# EAGLE schematic board (EAGLE 9.2.0)
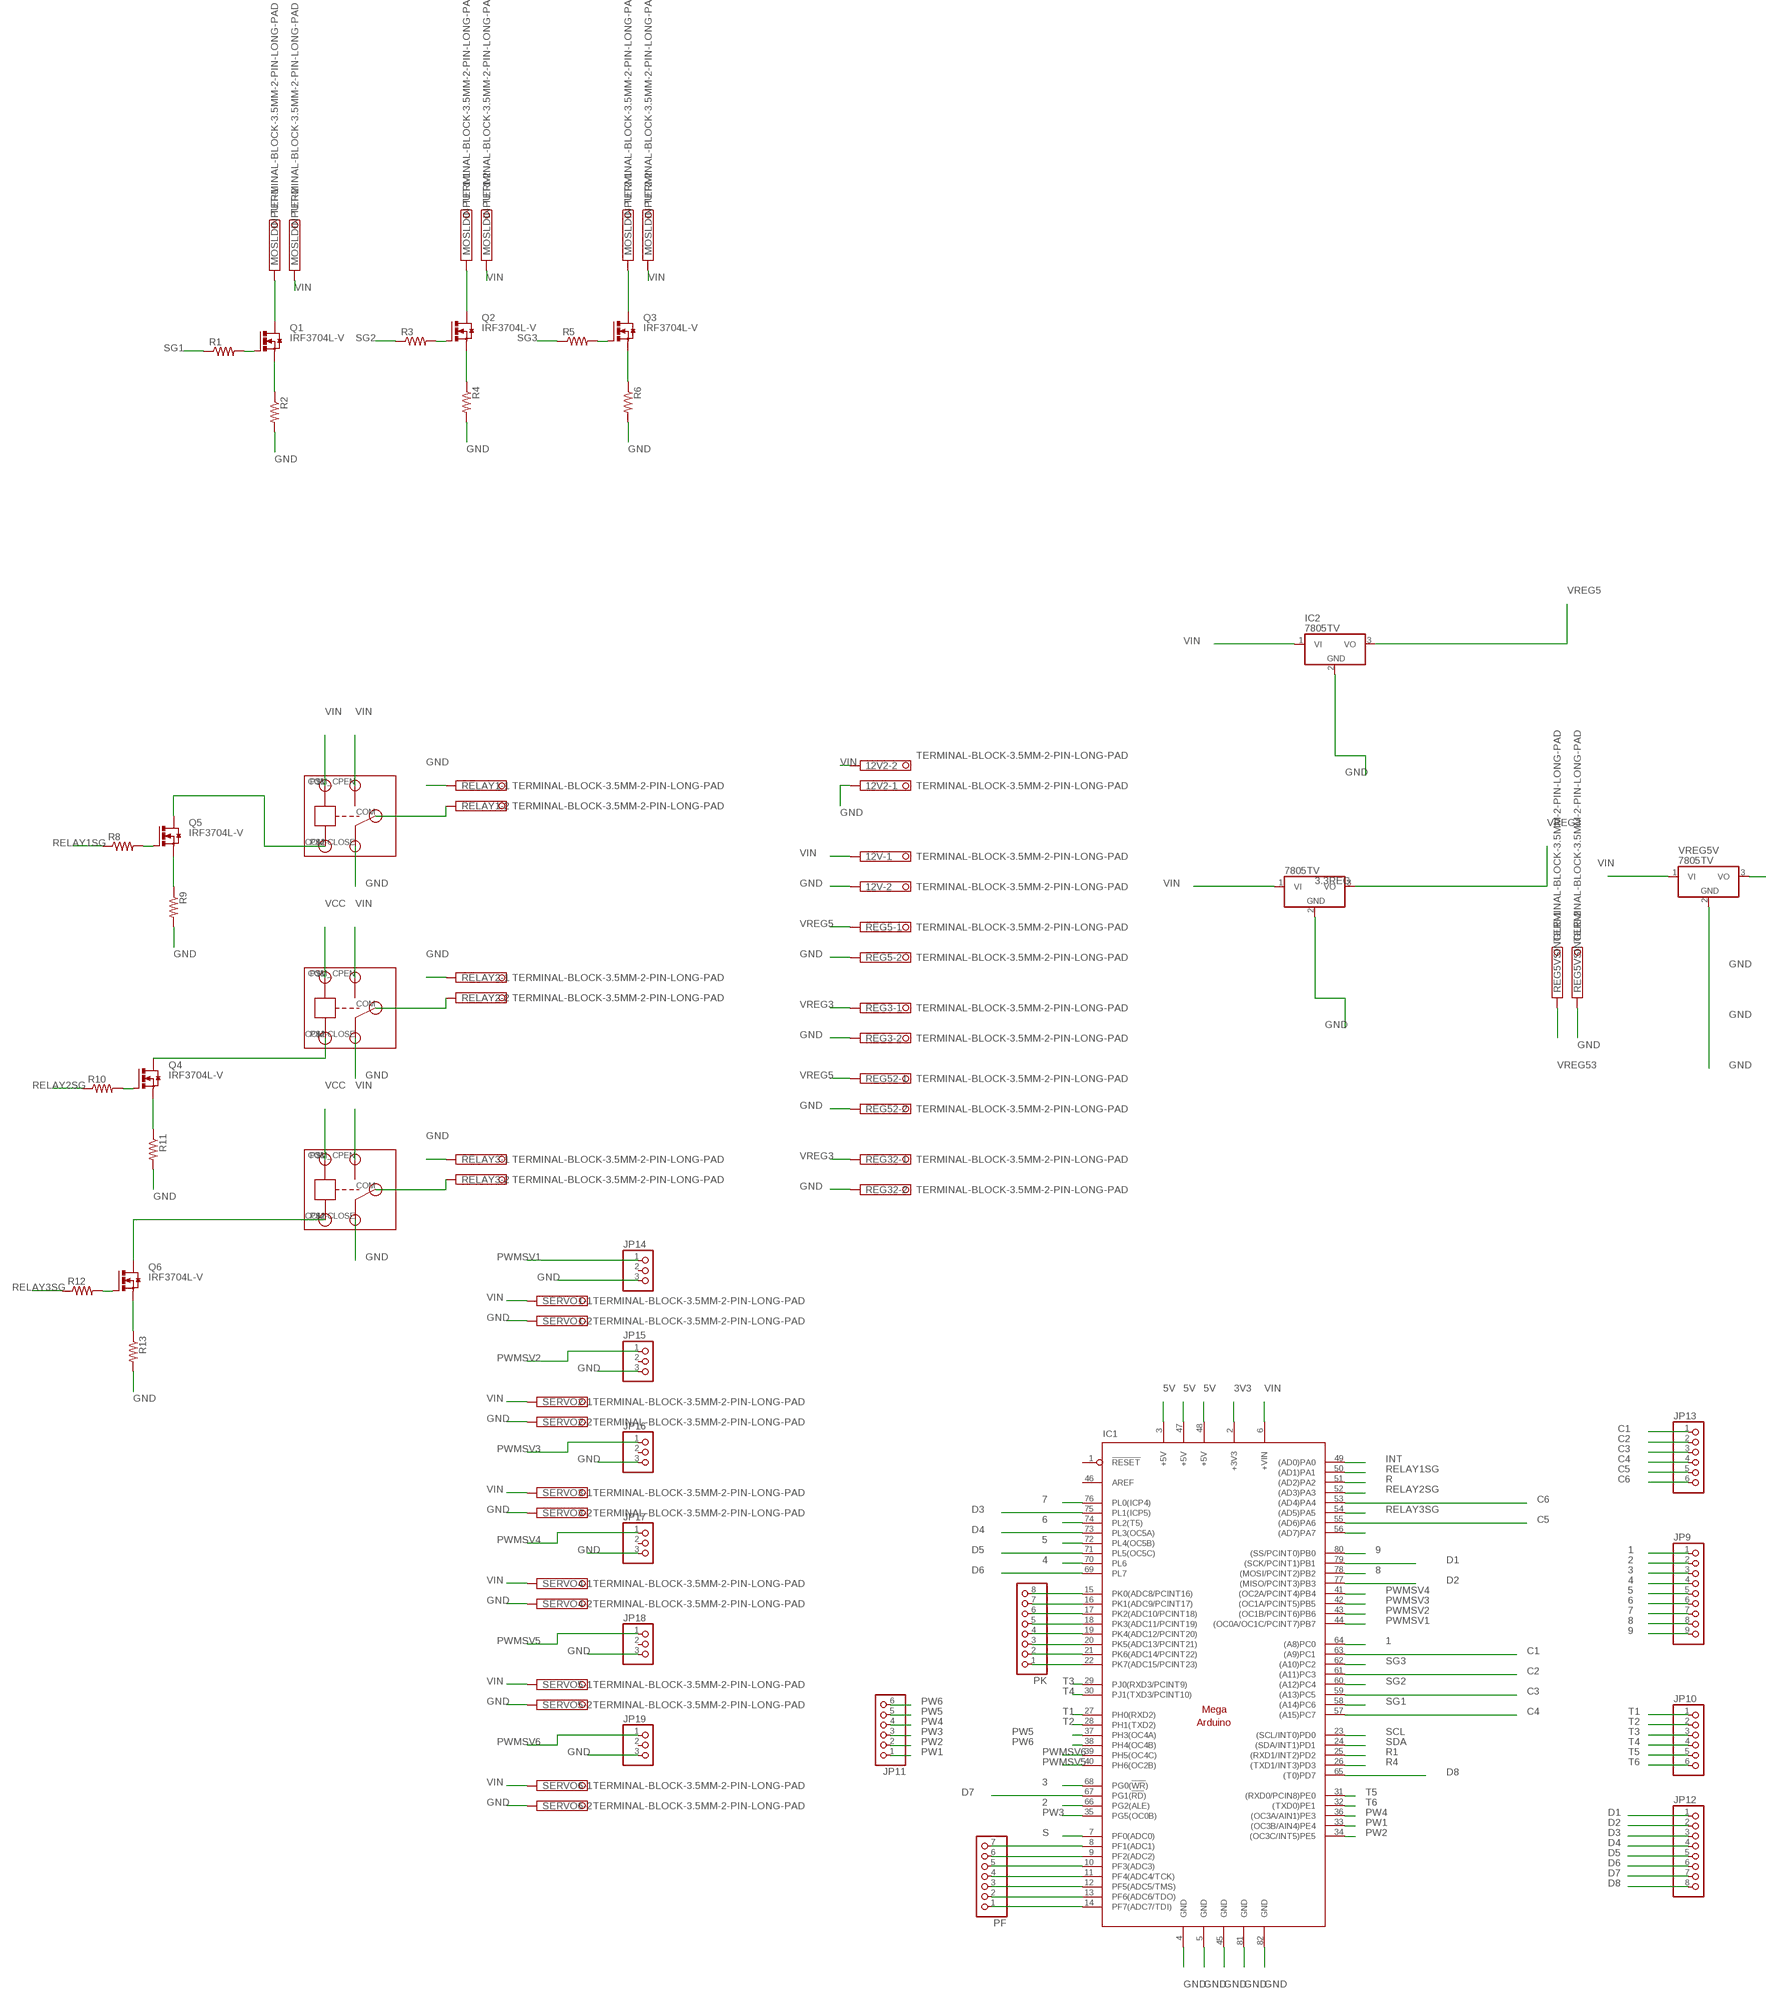
[diagram p0: schematic, sheet 1, part 1 of 2]
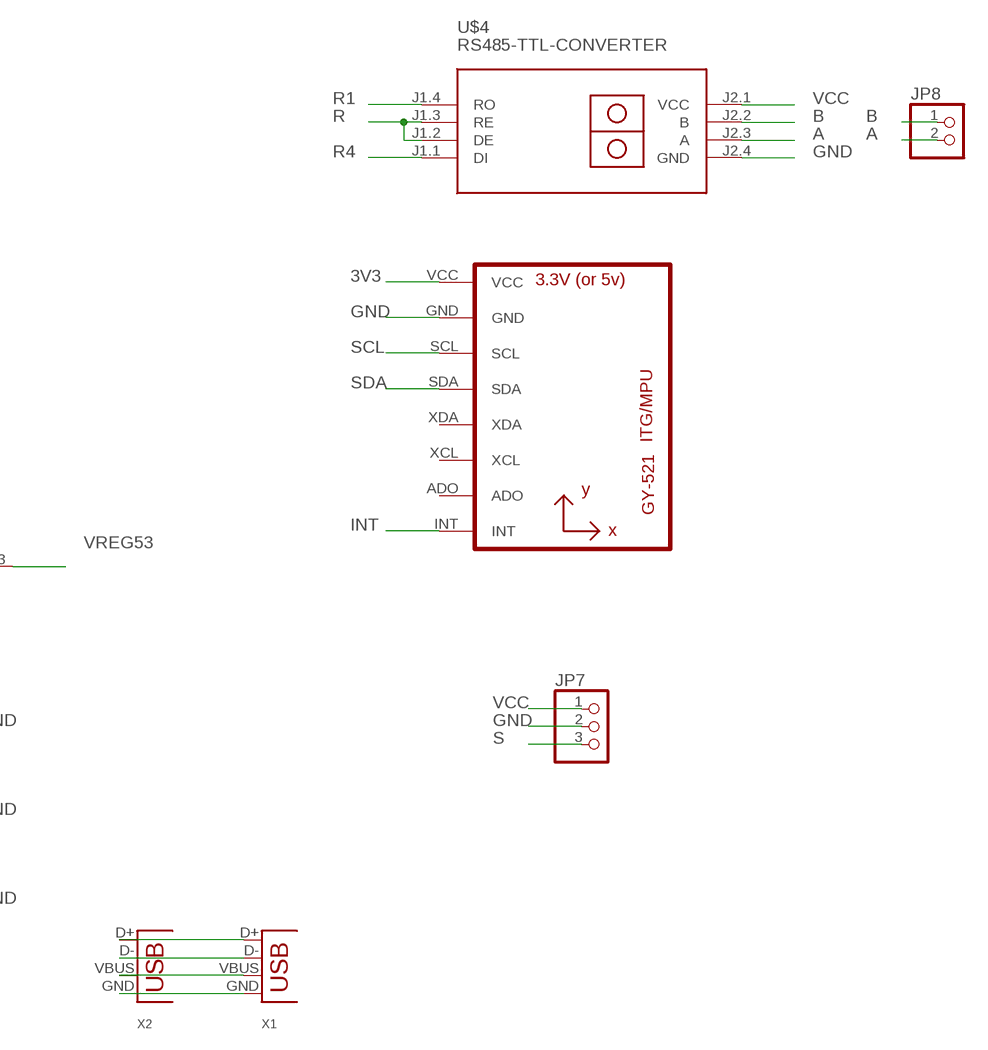
[diagram p1: schematic, sheet 1, part 2 of 2]

## Parts
3.3REG  7805TV  [TO220V]
12V  TERMINAL-BLOCK-3.5MM-2-PIN-LONG-PAD  [TERMINAL-BLOCK-2-PIN-3.5MM-LONG-PAD]
12V2  TERMINAL-BLOCK-3.5MM-2-PIN-LONG-PAD  [TERMINAL-BLOCK-2-PIN-3.5MM-LONG-PAD]
IC1  MEGAARDUINO_11  [MEGA_ARDUINO_1]
IC2  7805TV  [TO220V]
JP7  PINHD-1X3  [1X03]
JP8  PINHD-1X2  [1X02]
JP9  PINHD-1X9  [1X09]
JP10  PINHD-1X6  [1X06]
JP11  PINHD-1X6  [1X06]
JP12  PINHD-1X8  [1X08]
JP13  PINHD-1X6  [1X06]
JP14  PINHD-1X3  [1X03]
JP15  PINHD-1X3  [1X03]
JP16  PINHD-1X3  [1X03]
JP17  PINHD-1X3  [1X03]
JP18  PINHD-1X3  [1X03]
JP19  PINHD-1X3  [1X03]
MOSLDINPUT  TERMINAL-BLOCK-3.5MM-2-PIN-LONG-PAD  [TERMINAL-BLOCK-2-PIN-3.5MM-LONG-PAD]
MOSLDINPUT1  TERMINAL-BLOCK-3.5MM-2-PIN-LONG-PAD  [TERMINAL-BLOCK-2-PIN-3.5MM-LONG-PAD]
MOSLDINPUT2  TERMINAL-BLOCK-3.5MM-2-PIN-LONG-PAD  [TERMINAL-BLOCK-2-PIN-3.5MM-LONG-PAD]
PF  PINHD-1X7  [1X07]
PK  PINHD-1X8  [1X08]
Q1  IRF3704L-V  [TO262-V]
Q2  IRF3704L-V  [TO262-V]
Q3  IRF3704L-V  [TO262-V]
Q4  IRF3704L-V  [TO262-V]
Q5  IRF3704L-V  [TO262-V]
Q6  IRF3704L-V  [TO262-V]
R1  R-US_0204/7  [0204/7]
R2  R-US_0204/7  [0204/7]
R3  R-US_0204/7  [0204/7]
R4  R-US_0204/7  [0204/7]
R5  R-US_0204/7  [0204/7]
R6  R-US_0204/7  [0204/7]
R8  R-US_0204/7  [0204/7]
R9  R-US_0204/7  [0204/7]
R10  R-US_0204/7  [0204/7]
R11  R-US_0204/7  [0204/7]
R12  R-US_0204/7  [0204/7]
R13  R-US_0204/7  [0204/7]
REG3  TERMINAL-BLOCK-3.5MM-2-PIN-LONG-PAD  [TERMINAL-BLOCK-2-PIN-3.5MM-LONG-PAD]
REG5  TERMINAL-BLOCK-3.5MM-2-PIN-LONG-PAD  [TERMINAL-BLOCK-2-PIN-3.5MM-LONG-PAD]
REG5VSINGLE  TERMINAL-BLOCK-3.5MM-2-PIN-LONG-PAD  [TERMINAL-BLOCK-2-PIN-3.5MM-LONG-PAD]
REG32  TERMINAL-BLOCK-3.5MM-2-PIN-LONG-PAD  [TERMINAL-BLOCK-2-PIN-3.5MM-LONG-PAD]
REG52  TERMINAL-BLOCK-3.5MM-2-PIN-LONG-PAD  [TERMINAL-BLOCK-2-PIN-3.5MM-LONG-PAD]
RELAY1  TERMINAL-BLOCK-3.5MM-2-PIN-LONG-PAD  [TERMINAL-BLOCK-2-PIN-3.5MM-LONG-PAD]
RELAY2  TERMINAL-BLOCK-3.5MM-2-PIN-LONG-PAD  [TERMINAL-BLOCK-2-PIN-3.5MM-LONG-PAD]
RELAY3  TERMINAL-BLOCK-3.5MM-2-PIN-LONG-PAD  [TERMINAL-BLOCK-2-PIN-3.5MM-LONG-PAD]
SERVO1  TERMINAL-BLOCK-3.5MM-2-PIN-LONG-PAD  [TERMINAL-BLOCK-2-PIN-3.5MM-LONG-PAD]
SERVO2  TERMINAL-BLOCK-3.5MM-2-PIN-LONG-PAD  [TERMINAL-BLOCK-2-PIN-3.5MM-LONG-PAD]
SERVO3  TERMINAL-BLOCK-3.5MM-2-PIN-LONG-PAD  [TERMINAL-BLOCK-2-PIN-3.5MM-LONG-PAD]
SERVO4  TERMINAL-BLOCK-3.5MM-2-PIN-LONG-PAD  [TERMINAL-BLOCK-2-PIN-3.5MM-LONG-PAD]
SERVO5  TERMINAL-BLOCK-3.5MM-2-PIN-LONG-PAD  [TERMINAL-BLOCK-2-PIN-3.5MM-LONG-PAD]
SERVO6  TERMINAL-BLOCK-3.5MM-2-PIN-LONG-PAD  [TERMINAL-BLOCK-2-PIN-3.5MM-LONG-PAD]
U1  GY-521MPU6050  [GY-521]
U$1  RELAY  [RELAY]
U$2  RELAY  [RELAY]
U$3  RELAY  [RELAY]
U$4  RS485-TTL-CONVERTER  [RS485-TTL-CONVERTER]
VREG5V  7805TV  [TO220V]
X1  USB-A-H  [USB-A-H]
X2  USB-A-H  [USB-A-H]

## Nets
1: IC1.64((A8)PC0) JP9.1
2: IC1.66(PG2(ALE)) JP9.2
3: IC1.68(PG0(!WR!)) JP9.3
3V3: IC1.2(+3V3) U1.VCC
4: IC1.70(PL6) JP9.4
5: IC1.72(PL4(OC5B)) JP9.5
5V: IC1.3(+5V) IC1.47(+5V) IC1.48(+5V)
6: IC1.74(PL2(T5)) JP9.6
7: IC1.76(PL0(ICP4)) JP9.7
8: IC1.78((MOSI/PCINT2)PB2) JP9.8
9: IC1.80((SS/PCINT0)PB0) JP9.9
A: JP8.2 U$4.J2.3(A)
B: JP8.1 U$4.J2.2(B)
C1: IC1.63((A9)PC1) JP13.1
C2: IC1.61((A11)PC3) JP13.2
C3: IC1.59((A13)PC5) JP13.3
C4: IC1.57((A15)PC7) JP13.4
C5: IC1.55((AD6)PA6) JP13.5
C6: IC1.53((AD4)PA4) JP13.6
D1: IC1.79((SCK/PCINT1)PB1) JP12.1
D2: IC1.77((MISO/PCINT3)PB3) JP12.2
D3: IC1.75(PL1(ICP5)) JP12.3
D4: IC1.73(PL3(OC5A)) JP12.4
D5: IC1.71(PL5(OC5C)) JP12.5
D6: IC1.69(PL7) JP12.6
D7: IC1.67(PG1(!RD!)) JP12.7
D8: IC1.65((T0)PD7) JP12.8
GND: 3.3REG.2(GND) 12V2.1 12V.2 IC1.4(GND) IC1.5(GND) IC1.45(GND) IC1.81(GND) IC1.82(GND) IC2.2(GND) JP7.2 JP14.3 JP15.3 JP16.3 JP17.3 JP18.3 JP19.3 R2.2 R4.2 R6.2 R9.2 R11.2 R13.2 REG3.2 REG5.2 REG5VSINGLE.2 REG32.2 REG52.2 RELAY1.1 RELAY2.1 RELAY3.1 SERVO1.2 SERVO2.2 SERVO3.2 SERVO4.2 SERVO5.2 SERVO6.2 U1.GND U$1.COM-CLOSE U$2.COM-CLOSE U$3.COM-CLOSE U$4.J2.4(GND) VREG5V.2(GND)
INT: IC1.49((AD0)PA0) U1.INT
N$1: Q1.1(G) R1.2
N$2: MOSLDINPUT.1 Q1.2(D)
N$3: Q1.3(S) R2.1
N$4: Q2.1(G) R3.2
N$5: Q2.3(S) R4.1
N$6: MOSLDINPUT1.1 Q2.2(D)
N$7: Q3.1(G) R5.2
N$8: Q3.3(S) R6.1
N$9: MOSLDINPUT2.1 Q3.2(D)
N$10: RELAY1.2 U$1.COM
N$11: RELAY2.2 U$2.COM
N$12: RELAY3.2 U$3.COM
N$13: IC1.8(PF1(ADC1)) PF.7
N$14: IC1.9(PF2(ADC2)) PF.6
N$15: IC1.10(PF3(ADC3)) PF.5
N$16: Q5.1(G) R8.2
N$17: Q5.3(S) R9.1
N$22: X1.GND X2.GND
N$23: X1.VBUS X2.VBUS
N$24: IC1.56((AD7)PA7)
N$25: Q5.2(D) U$1.P$2(GND)
N$26: Q4.1(G) R10.2
N$27: Q4.3(S) R11.1
N$28: IC1.11(PF4(ADC4/TCK)) PF.4
N$29: Q4.2(D) U$2.P$2(GND)
N$30: Q6.1(G) R12.2
N$31: Q6.3(S) R13.1
N$32: Q6.2(D) U$3.P$2(GND)
N$33: IC1.12(PF5(ADC5/TMS)) PF.3
N$34: IC1.13(PF6(ADC6/TDO)) PF.2
N$35: IC1.14(PF7(ADC7/TDI)) PF.1
N$36: IC1.15(PK0(ADC8/PCINT16)) PK.8
N$37: IC1.16(PK1(ADC9/PCINT17)) PK.7
N$38: IC1.17(PK2(ADC10/PCINT18)) PK.6
N$39: IC1.18(PK3(ADC11/PCINT19)) PK.5
N$40: IC1.19(PK4(ADC12/PCINT20)) PK.4
N$41: IC1.20(PK5(ADC13/PCINT21)) PK.3
N$42: IC1.21(PK6(ADC14/PCINT22)) PK.2
N$43: IC1.22(PK7(ADC15/PCINT23)) PK.1
N$44: X1.D- X2.D-
N$45: X1.D+ X2.D+
PW1: IC1.33((OC3B/AIN4)PE4) JP11.1
PW2: IC1.34((OC3C/INT5)PE5) JP11.2
PW3: IC1.35(PG5(OC0B)) JP11.3
PW4: IC1.36((OC3A/AIN1)PE3) JP11.4
PW5: IC1.37(PH3(OC4A)) JP11.5
PW6: IC1.38(PH4(OC4B)) JP11.6
PWMSV1: IC1.44((OC0A/OC1C/PCINT7)PB7) JP14.1
PWMSV2: IC1.43((OC1B/PCINT6)PB6) JP15.1
PWMSV3: IC1.42((OC1A/PCINT5)PB5) JP16.1
PWMSV4: IC1.41((OC2A/PCINT4)PB4) JP17.1
PWMSV5: IC1.40(PH6(OC2B)) JP18.1
PWMSV6: IC1.39(PH5(OC4C)) JP19.1
R: IC1.51((AD2)PA2) U$4.J1.2(DE) U$4.J1.3(RE)
R1: IC1.25((RXD1/INT2)PD2) U$4.J1.4(RO)
R4: IC1.26((TXD1/INT3)PD3) U$4.J1.1(DI)
RELAY1SG: IC1.50((AD1)PA1) R8.1
RELAY2SG: IC1.52((AD3)PA3) R10.1
RELAY3SG: IC1.54((AD5)PA5) R12.1
S: IC1.7(PF0(ADC0)) JP7.3
SCL: IC1.23((SCL/INT0)PD0) U1.SCL
SDA: IC1.24((SDA/INT1)PD1) U1.SDA
SG1: IC1.58((A14)PC6) R1.1
SG2: IC1.60((A12)PC4) R3.1
SG3: IC1.62((A10)PC2) R5.1
T1: IC1.27(PH0(RXD2)) JP10.1
T2: IC1.28(PH1(TXD2)) JP10.2
T3: IC1.29(PJ0(RXD3/PCINT9)) JP10.3
T4: IC1.30(PJ1(TXD3/PCINT10)) JP10.4
T5: IC1.31((RXD0/PCIN8)PE0) JP10.5
T6: IC1.32((TXD0)PE1) JP10.6
VCC: JP7.1 U$2.P$1(IN) U$3.P$1(IN) U$4.J2.1(VCC)
VIN: 3.3REG.1(VI) 12V2.2 12V.1 IC1.6(+VIN) IC2.1(VI) MOSLDINPUT1.2 MOSLDINPUT2.2 MOSLDINPUT.2 SERVO1.1 SERVO2.1 SERVO3.1 SERVO4.1 SERVO5.1 SERVO6.1 U$1.COM_CPEN(COM-OPEN) U$1.P$1(IN) U$2.COM_CPEN(COM-OPEN) U$3.COM_CPEN(COM-OPEN) VREG5V.1(VI)
VREG3: 3.3REG.3(VO) REG3.1 REG32.1
VREG5: IC2.3(VO) REG5.1 REG52.1
VREG53: REG5VSINGLE.1 VREG5V.3(VO)
Unconnected: IC1.1(!RESET) IC1.46(AREF) JP14.2 JP15.2 JP16.2 JP17.2 JP18.2 JP19.2 U1.ADO U1.XCL U1.XDA

## Library data of the parts
3.3REG IC2 VREG5V = linear:78*: Positive VOLTAGE REGULATOR Source: http://cache.national.com/ds/LM/LM78L05.pdf http://www.fairchildsemi.com/ds/LM/LM7805.pdf
12V 12V2 MOSLDINPUT MOSLDINPUT1 MOSLDINPUT2 REG3 REG5 REG5VSINGLE REG32 REG52 RELAY1-RELAY3 SERVO1-SERVO6 = Rembrandt Electronics - Terminal Block 3-5mm v1-0:TERMINAL-BLOCK-3.5MM-2-PIN: Terminal Block 3.5mm Pitch: 3,5 mm Number of pins: 2 Created by Rembrandt Electronics www.rembrandtelectronics.com
IC1 = arduino:MEGAARDUINO_1: The Arduino Mega is a microcontroller board based on the ATmega1280. - 54 digital input/output pins (of which 14 can be used as PWM outputs) - 16 analog inputs - 4 UARTs (hardware serial ports) - 16 MHz crystal oscillator - USB connection - power jack - ICSP header - reset button It contains everything needed to support the microcontroller; simply connect it to a computer with a USB cable or power it with a AC-to-DC adapter or battery to get started. The Mega is compatible with most shields designed for the Arduino Duemilanove or Diecimila. http://arduino.cc/en/Main/ArduinoBoardMega
JP7 JP14-JP19 = pinhead:PINHD-1X3: PIN HEADER
JP8 = pinhead:PINHD-1X2: PIN HEADER
JP9 = pinhead:PINHD-1X9: PIN HEADER
JP10 JP11 JP13 = pinhead:PINHD-1X6: PIN HEADER
JP12 PK = pinhead:PINHD-1X8: PIN HEADER
PF = pinhead:PINHD-1X7: PIN HEADER
Q1-Q6 = transistor-power:IRF3704: SMPS MOSFET HEXFET® Power MOSFET Source: http://www.irf.com/product-info/datasheets/data/irf3704.pdf
R1-R6 R8-R13 = rcl:R-US_: RESISTOR, American symbol; SPICEPREFIX: R
U1 = gy-521:GY-521
U$1-U$3 = RELAY:RELAY
U$4 = diy-modules:RS485-TTL-CONVERTER: RS485 to TTL converter based on MAX485 chip
X1 X2 = con-usb-3:USB: USB Connectors